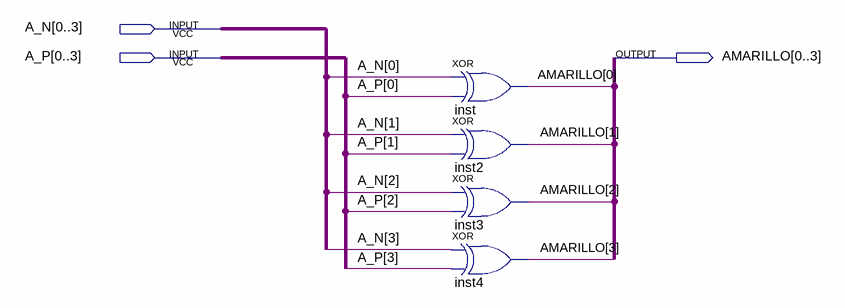
[diagram p0: schematic sheet]
// Quartus schematic AMARILLOEXCLUSIVO.bdf as structural Verilog: 4 symbols, 3 pins
module AMARILLOEXCLUSIVO (
  input  [0:3] A_N,
  input  [0:3] A_P,
  output [0:3] AMARILLO
);

  xor inst (AMARILLO[0], A_N[0], A_P[0]);
  xor inst2 (AMARILLO[1], A_N[1], A_P[1]);
  xor inst3 (AMARILLO[2], A_N[2], A_P[2]);
  xor inst4 (AMARILLO[3], A_N[3], A_P[3]);
endmodule
